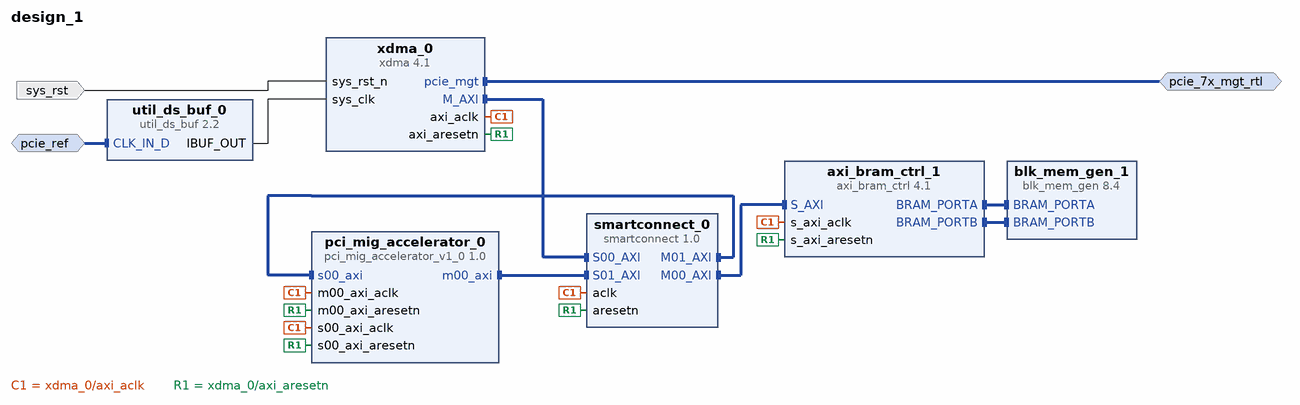
[diagram p0: block diagram of the top level]
# Vivado block design design_1, xc7vx485tffg1761-2, Vivado 2021.1
create_bd_design design_1

create_bd_intf_port -mode Master -vlnv xilinx.com:interface:pcie_7x_mgt_rtl:1.0 pcie_7x_mgt_rtl
create_bd_intf_port -mode Slave -vlnv xilinx.com:interface:diff_clock_rtl:1.0 pcie_ref
create_bd_port -dir I -type rst sys_rst
set_property -dict {CONFIG.POLARITY ACTIVE_LOW} [get_bd_ports sys_rst]

create_bd_cell -type ip -vlnv xilinx.com:ip:xdma:4.1 xdma_0
set_property -dict [list \
  CONFIG.PF0_DEVICE_ID_mqdma 9028 \
  CONFIG.PF0_SRIOV_VF_DEVICE_ID A038 \
  CONFIG.PF2_DEVICE_ID_mqdma 9228 \
  CONFIG.PF3_DEVICE_ID_mqdma 9328 \
  CONFIG.SYS_RST_N_BOARD_INTERFACE Custom \
  CONFIG.axi_data_width 128_bit \
  CONFIG.axisten_freq 250 \
  CONFIG.mode_selection Basic \
  CONFIG.pf0_base_class_menu Memory_controller \
  CONFIG.pf0_class_code_base 05 \
  CONFIG.pf0_class_code_interface 00 \
  CONFIG.pf0_class_code_sub 80 \
  CONFIG.pf0_device_id 7028 \
  CONFIG.pf0_sub_class_interface_menu Other_memory_controller \
  CONFIG.pl_link_cap_max_link_speed 5.0_GT/s \
  CONFIG.pl_link_cap_max_link_width X8 \
  CONFIG.plltype QPLL1 \
  CONFIG.ref_clk_freq 100_MHz \
  CONFIG.xdma_axi_intf_mm AXI_Memory_Mapped \
  CONFIG.xdma_rnum_chnl 1 \
  CONFIG.xdma_wnum_chnl 1 \
] [get_bd_cells xdma_0]
create_bd_cell -type ip -vlnv xilinx.com:ip:smartconnect:1.0 smartconnect_0
set_property -dict {CONFIG.NUM_MI 2} [get_bd_cells smartconnect_0]
create_bd_cell -type ip -vlnv xilinx.com:ip:util_ds_buf:2.2 util_ds_buf_0
set_property -dict {CONFIG.C_BUF_TYPE IBUFDSGTE} [get_bd_cells util_ds_buf_0]
create_bd_cell -type ip -vlnv xilinx.com:ip:axi_bram_ctrl:4.1 axi_bram_ctrl_1
set_property -dict {CONFIG.DATA_WIDTH 512 CONFIG.READ_LATENCY 1} [get_bd_cells axi_bram_ctrl_1]
create_bd_cell -type ip -vlnv xilinx.com:ip:blk_mem_gen:8.4 blk_mem_gen_1
set_property -dict [list \
  CONFIG.Assume_Synchronous_Clk true \
  CONFIG.EN_SAFETY_CKT true \
  CONFIG.Enable_32bit_Address true \
  CONFIG.Enable_B Use_ENB_Pin \
  CONFIG.Memory_Type True_Dual_Port_RAM \
  CONFIG.Port_B_Clock 100 \
  CONFIG.Port_B_Enable_Rate 100 \
  CONFIG.Port_B_Write_Rate 50 \
  CONFIG.Read_Width_A 512 \
  CONFIG.Read_Width_B 512 \
  CONFIG.Register_PortA_Output_of_Memory_Primitives false \
  CONFIG.Register_PortB_Output_of_Memory_Primitives false \
  CONFIG.Use_RSTA_Pin true \
  CONFIG.Use_RSTB_Pin true \
  CONFIG.Write_Width_A 512 \
  CONFIG.Write_Width_B 512 \
  CONFIG.use_bram_block BRAM_Controller \
] [get_bd_cells blk_mem_gen_1]
create_bd_cell -type ip -vlnv user.org:user:pci_mig_accelerator_v1_0:1.0 pci_mig_accelerator_0
set_property -dict [list \
  CONFIG.C_M00_AXI_ADDR_WIDTH 33 \
  CONFIG.C_M00_AXI_DATA_WIDTH 512 \
  CONFIG.C_M00_AXI_TARGET_SLAVE_BASE_ADDR 0x00000000 \
  CONFIG.C_S00_AXI_ADDR_WIDTH 32 \
  CONFIG.C_S00_AXI_DATA_WIDTH 512 \
] [get_bd_cells pci_mig_accelerator_0]

# ---- connections ----

connect_bd_intf_net -intf_net CLK_IN_D_0_1 [get_bd_intf_ports pcie_ref] [get_bd_intf_pins util_ds_buf_0/CLK_IN_D]
connect_bd_intf_net [get_bd_intf_pins axi_bram_ctrl_1/BRAM_PORTA] [get_bd_intf_pins blk_mem_gen_1/BRAM_PORTA]
connect_bd_intf_net [get_bd_intf_pins axi_bram_ctrl_1/BRAM_PORTB] [get_bd_intf_pins blk_mem_gen_1/BRAM_PORTB]
connect_bd_intf_net [get_bd_intf_pins smartconnect_0/S01_AXI] [get_bd_intf_pins pci_mig_accelerator_0/m00_axi]
connect_bd_intf_net [get_bd_intf_pins smartconnect_0/M00_AXI] [get_bd_intf_pins axi_bram_ctrl_1/S_AXI]
connect_bd_intf_net [get_bd_intf_pins smartconnect_0/M01_AXI] [get_bd_intf_pins pci_mig_accelerator_0/s00_axi]
connect_bd_intf_net [get_bd_intf_pins xdma_0/M_AXI] [get_bd_intf_pins smartconnect_0/S00_AXI]
connect_bd_intf_net [get_bd_intf_ports pcie_7x_mgt_rtl] [get_bd_intf_pins xdma_0/pcie_mgt]
connect_bd_net -net reset_rtl_1 [get_bd_ports sys_rst] [get_bd_pins xdma_0/sys_rst_n]
connect_bd_net [get_bd_pins util_ds_buf_0/IBUF_OUT] [get_bd_pins xdma_0/sys_clk]
connect_bd_net [get_bd_pins xdma_0/axi_aclk] \
  [get_bd_pins smartconnect_0/aclk] [get_bd_pins axi_bram_ctrl_1/s_axi_aclk] [get_bd_pins pci_mig_accelerator_0/s00_axi_aclk] \
  [get_bd_pins pci_mig_accelerator_0/m00_axi_aclk]
connect_bd_net [get_bd_pins xdma_0/axi_aresetn] \
  [get_bd_pins smartconnect_0/aresetn] [get_bd_pins axi_bram_ctrl_1/s_axi_aresetn] \
  [get_bd_pins pci_mig_accelerator_0/s00_axi_aresetn] [get_bd_pins pci_mig_accelerator_0/m00_axi_aresetn]

# ---- address map ----
assign_bd_address -offset 0x000000000 -range 32K -target_address_space [get_bd_addr_spaces pci_mig_accelerator_0/m00_axi] [get_bd_addr_segs axi_bram_ctrl_1/S_AXI/Mem0]
assign_bd_address -offset 0x100000000 -range 64K -target_address_space [get_bd_addr_spaces pci_mig_accelerator_0/m00_axi] [get_bd_addr_segs pci_mig_accelerator_0/s00_axi/reg0]
assign_bd_address -offset 0x0000000000000000 -range 32K -target_address_space [get_bd_addr_spaces xdma_0/M_AXI] [get_bd_addr_segs axi_bram_ctrl_1/S_AXI/Mem0]
assign_bd_address -offset 0x0000000100000000 -range 64K -target_address_space [get_bd_addr_spaces xdma_0/M_AXI] [get_bd_addr_segs pci_mig_accelerator_0/s00_axi/reg0]

validate_bd_design
save_bd_design
